# EasyEDA Pro project ACS Core.eprj, schematic Card Slot Reader

## Sheets
1 P1: Create Date: 2026-01-15; Page Name: P1; Project Name: Project Name; Schematic Name: Schematic Name; Update Date: 2021.11.05; Company: EasyEDA.com; Page Size: A4; Version: V1.0
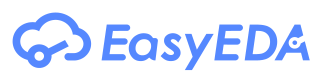
[diagram p0: P1]
2 NFC Reader: Board Name: Board1; Page Name: NFC Reader; Project Name: Card Reader 3.0.0; Schematic Name: Schematic1; Update Date: 2026-01-15
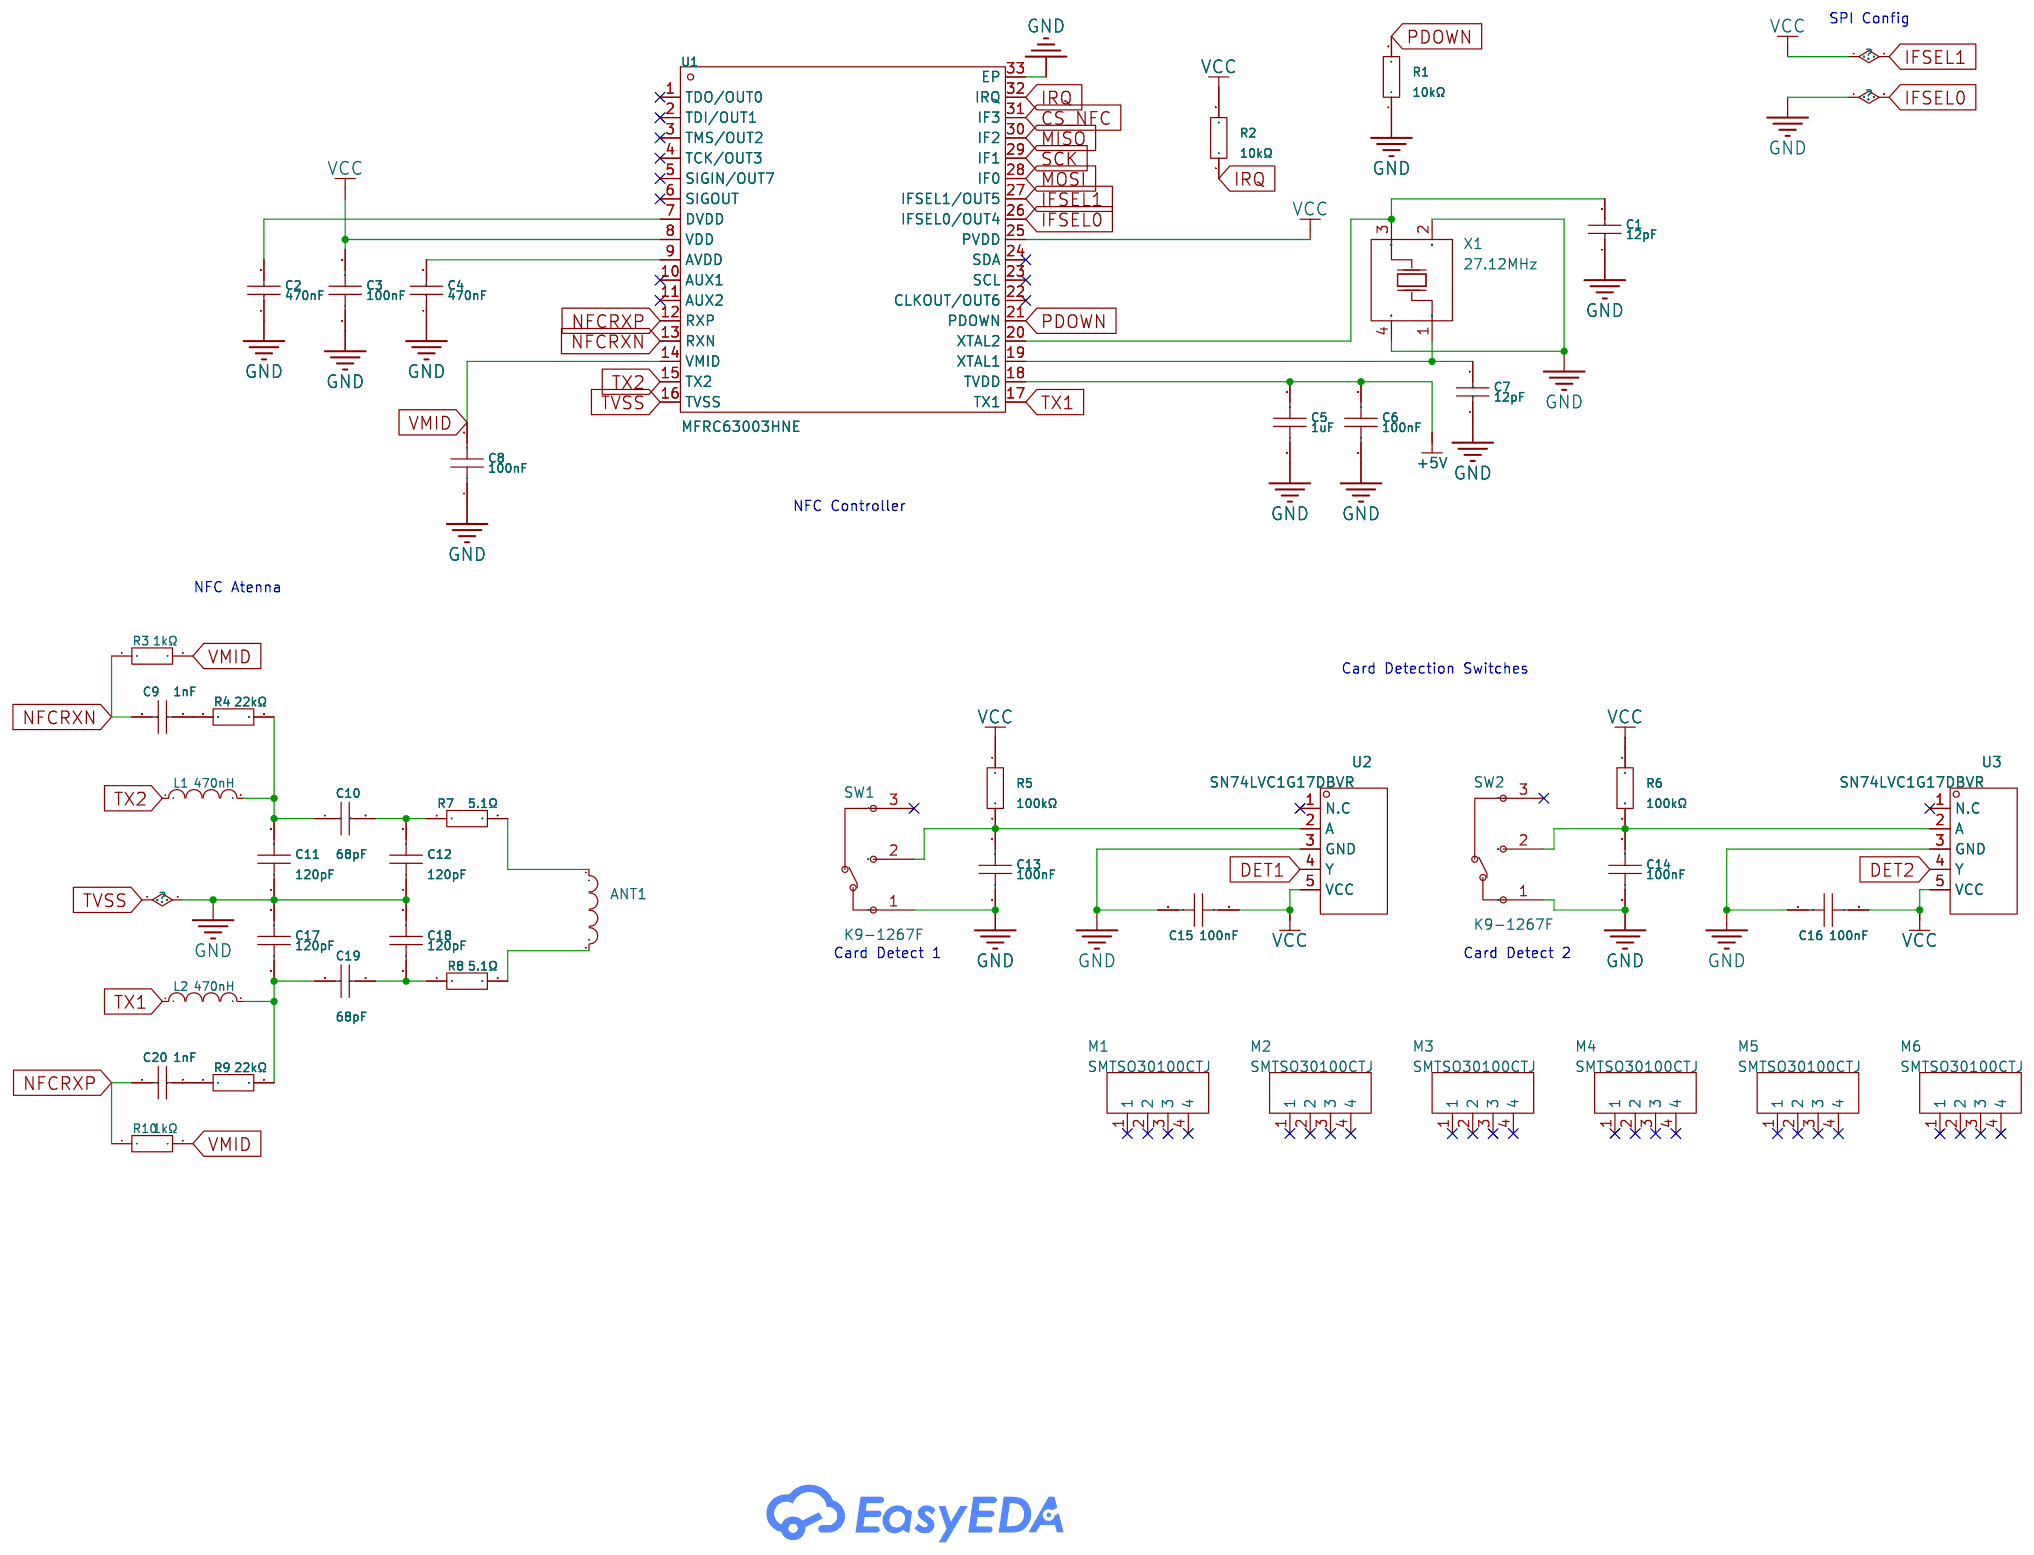
[diagram p1: NFC Reader]
3 Interfaces: Board Name: Card Slot Reader; Page Name: Interfaces; Project Name: ACS Core; Schematic Name: Card Slot Reader; Update Date: 2026-01-16
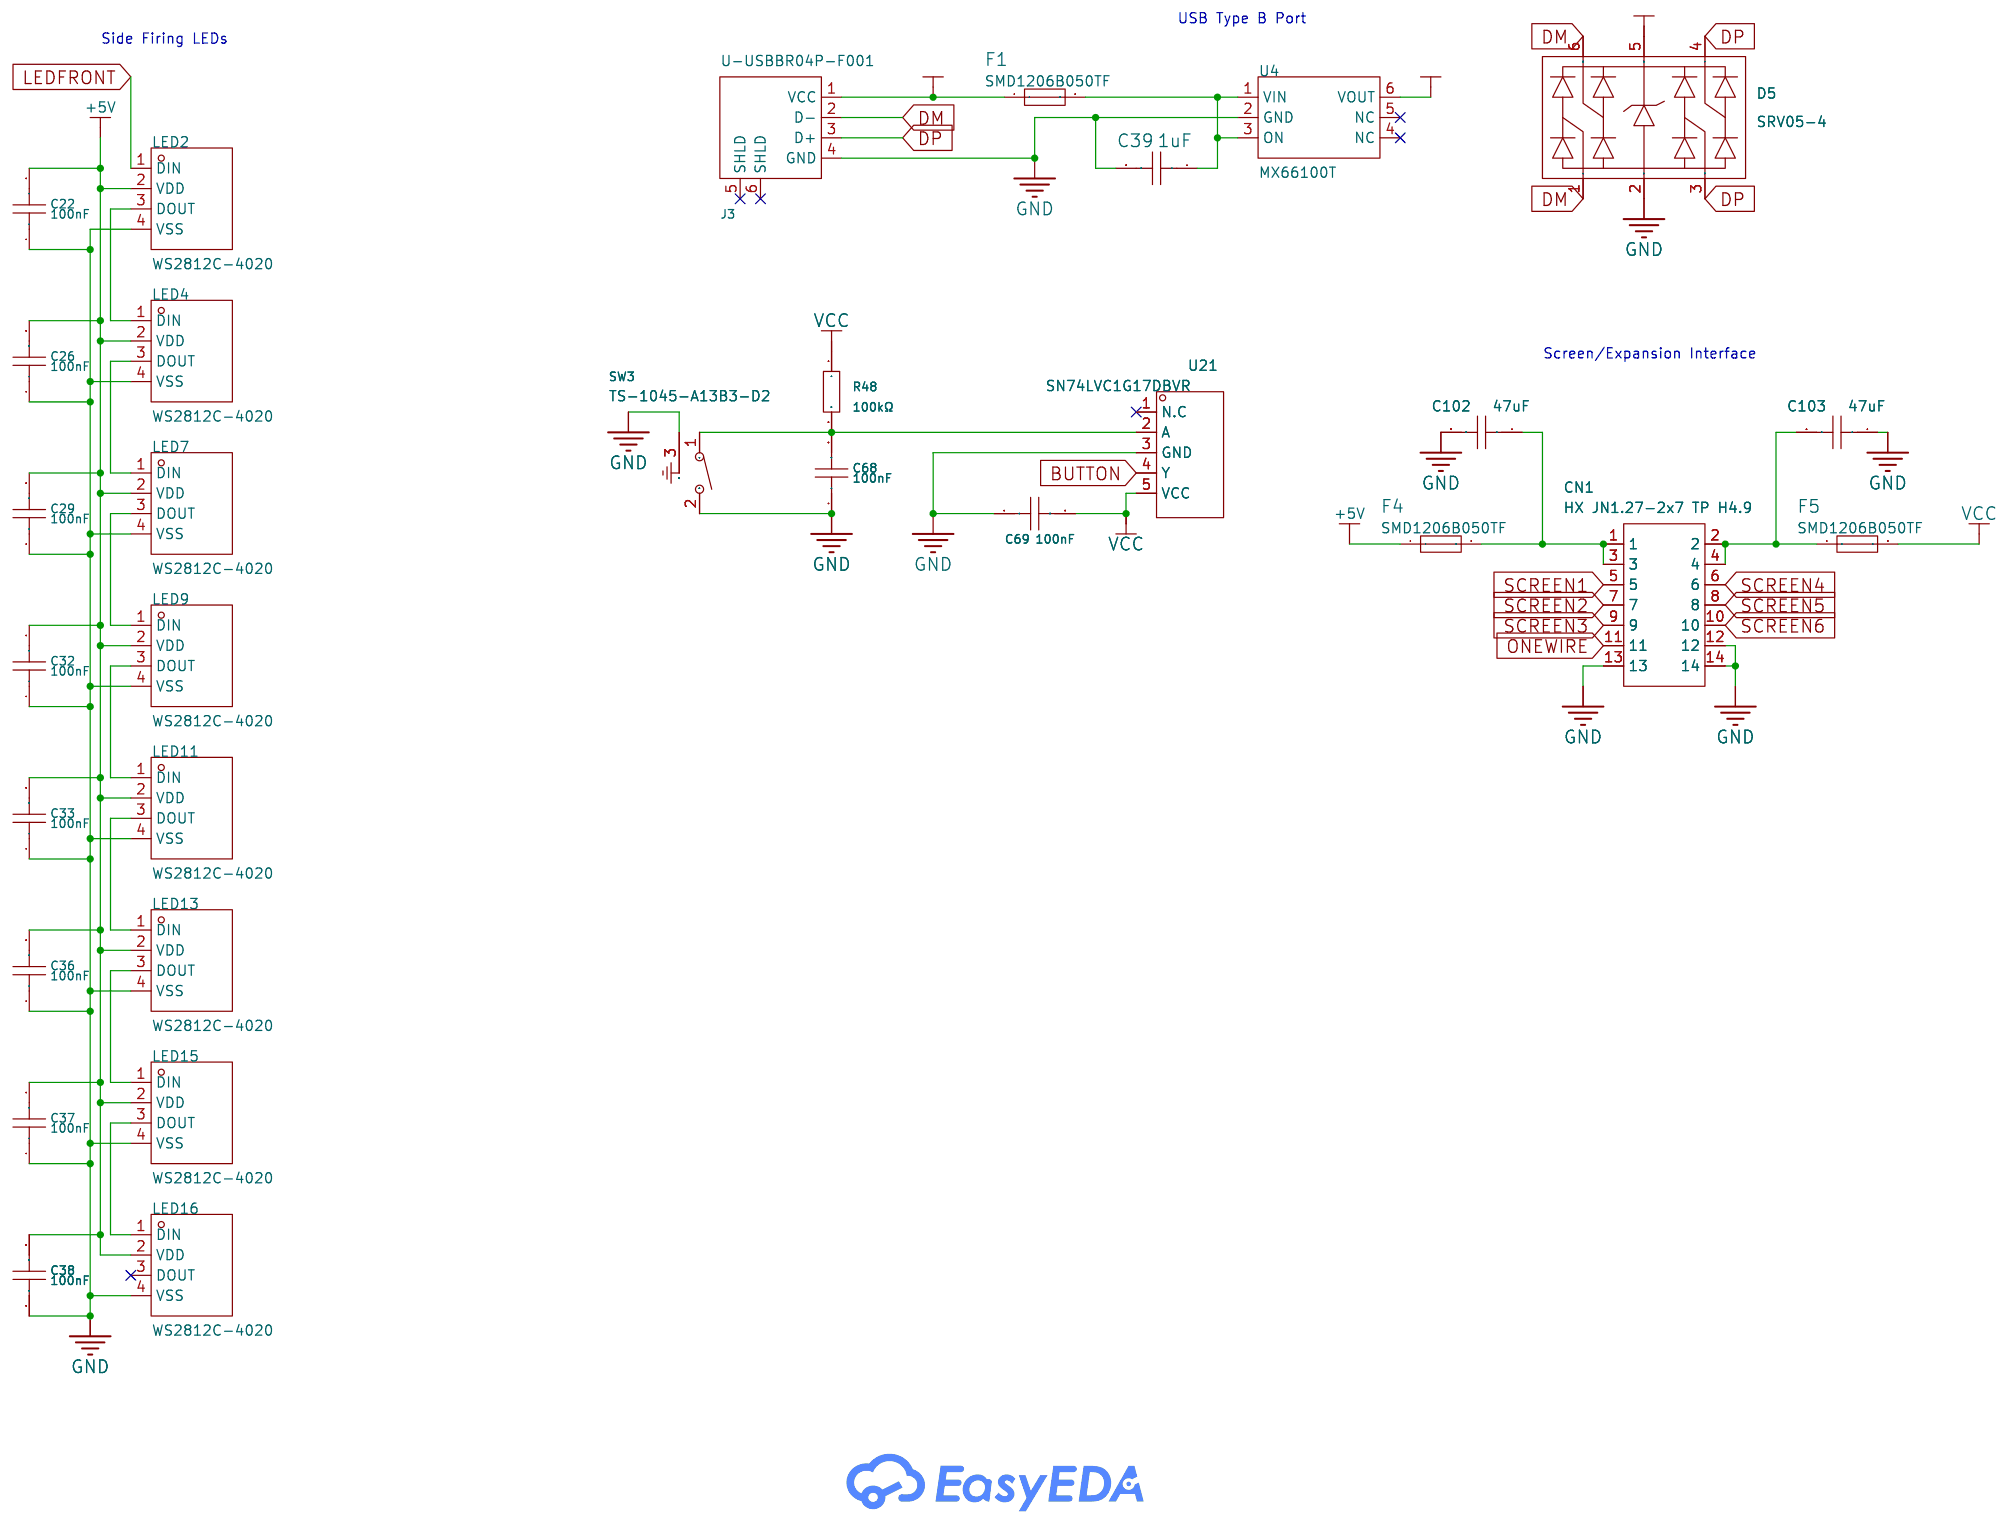
[diagram p2: Interfaces]
4 Bus Connection: Board Name: Card Slot Reader; Create Date: 2026-01-16; Page Name: Bus Connection; Project Name: ACS Core; Schematic Name: Card Slot Reader; Update Date: 2026-01-16
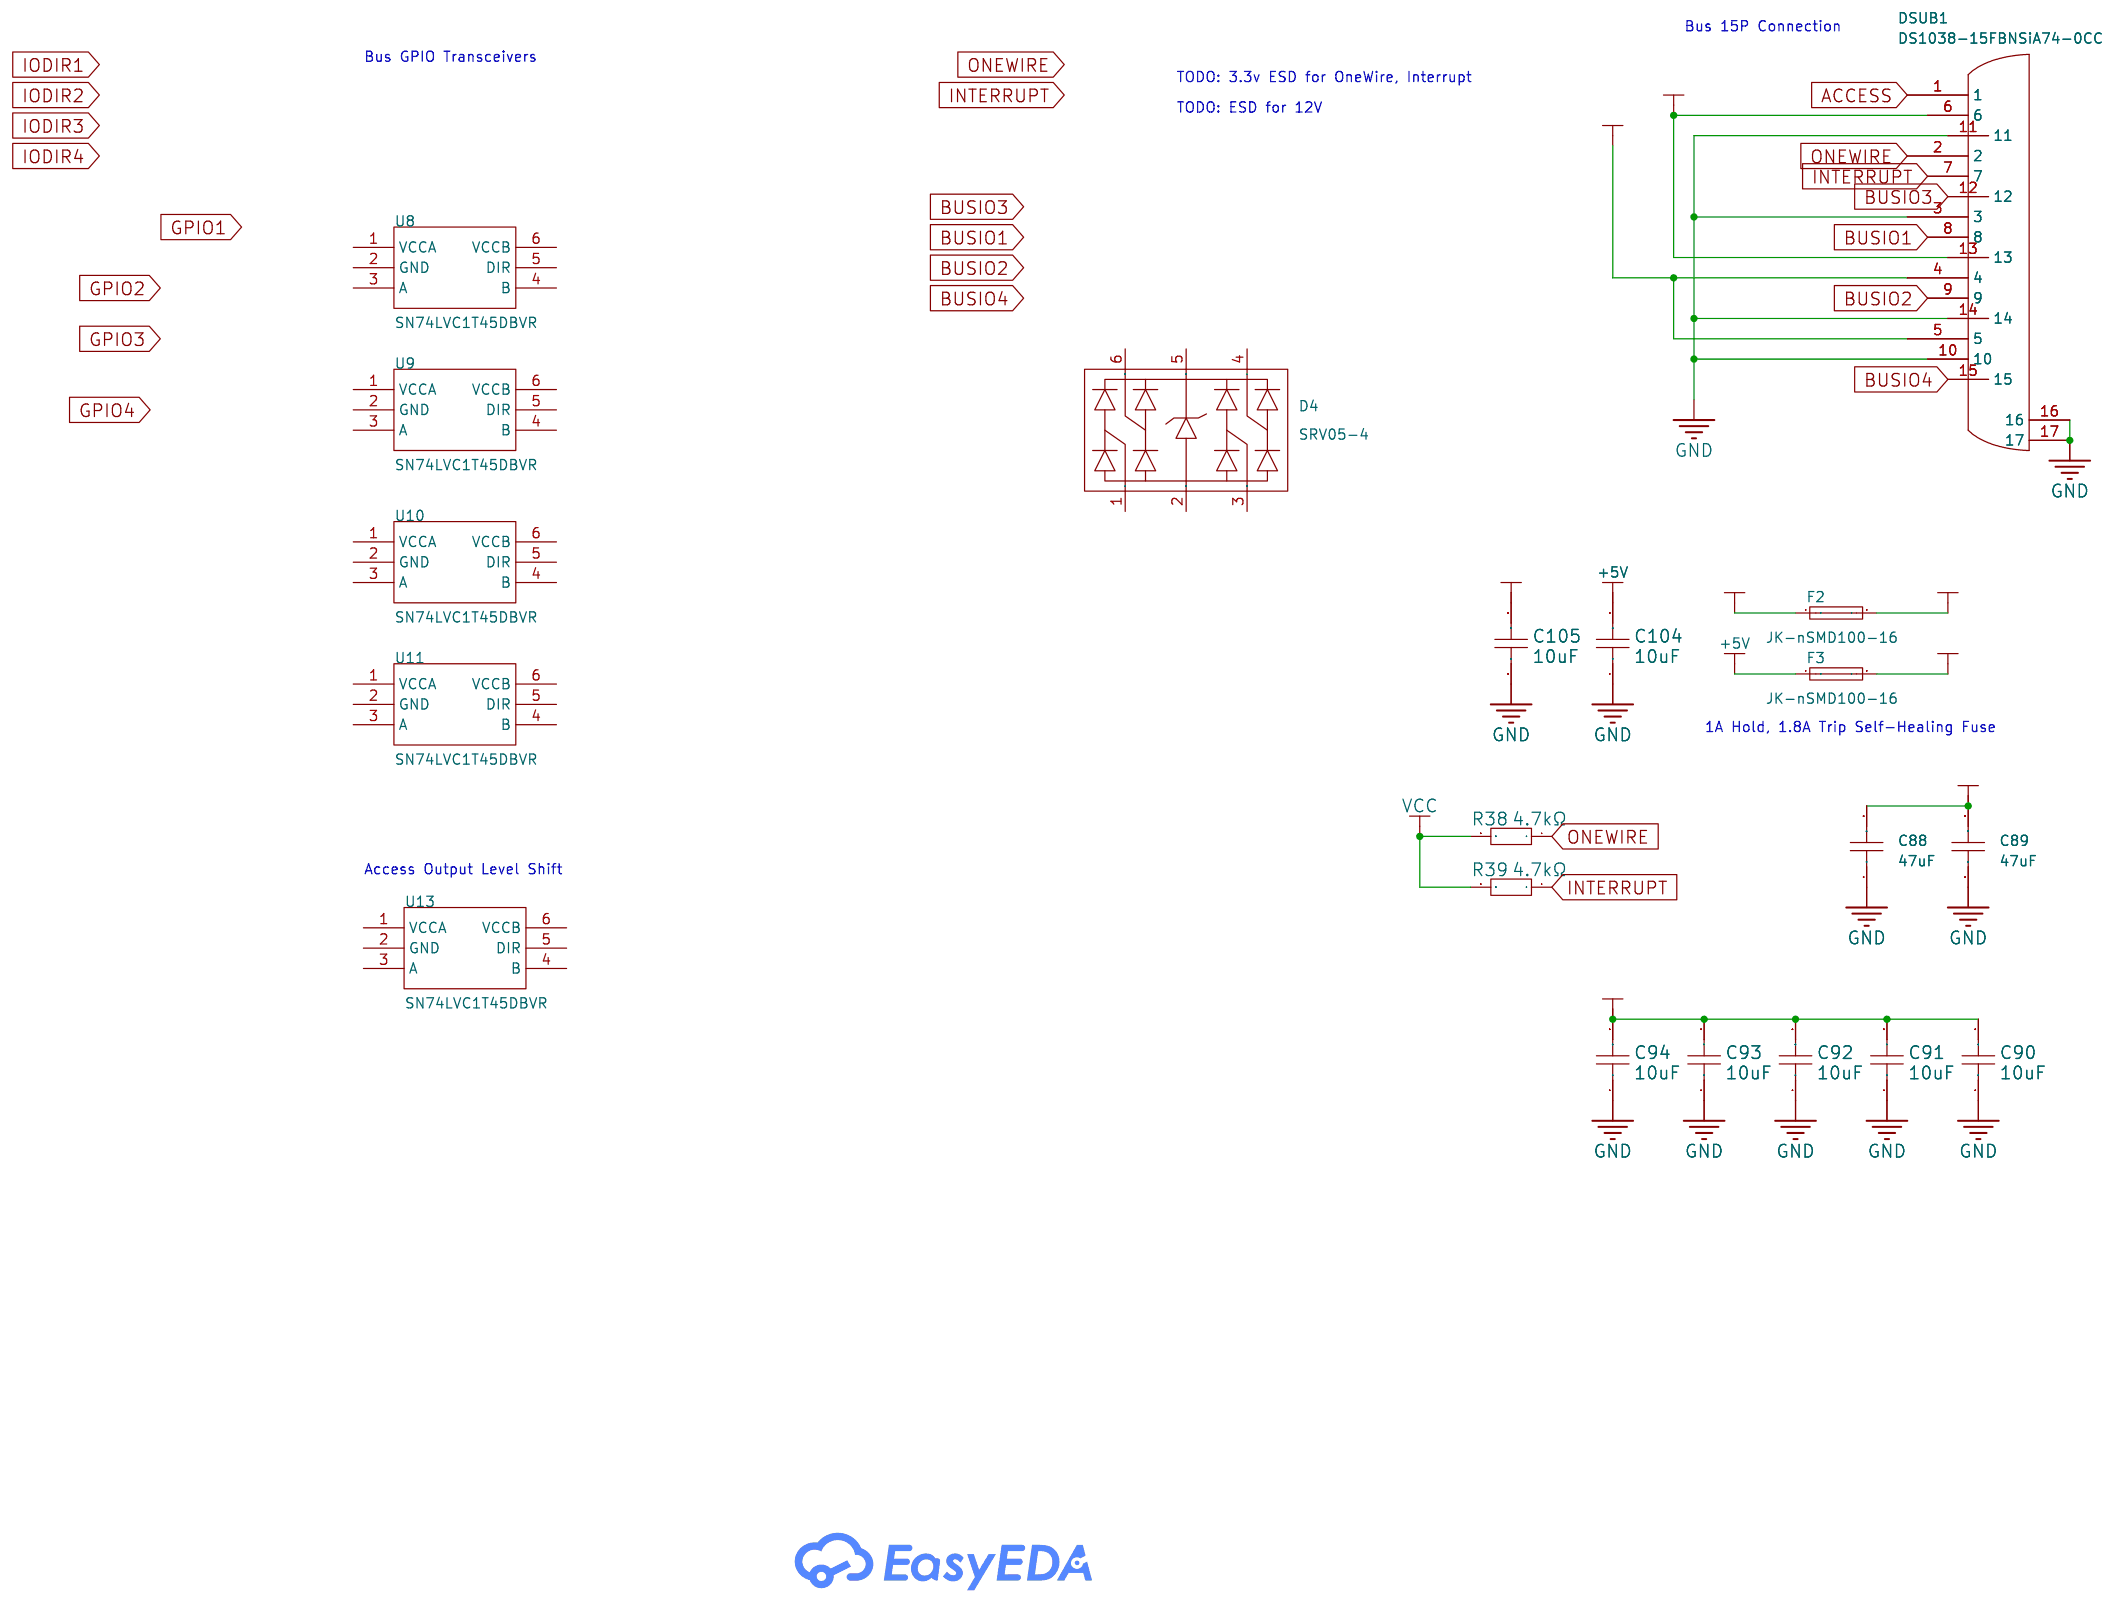
[diagram p3: Bus Connection]
5 Regulators: Board Name: Board1; Create Date: 2026-01-16; Page Name: Regulators; Project Name: Card Reader 3.0.0; Schematic Name: Schematic1; Update Date: 2026-01-16
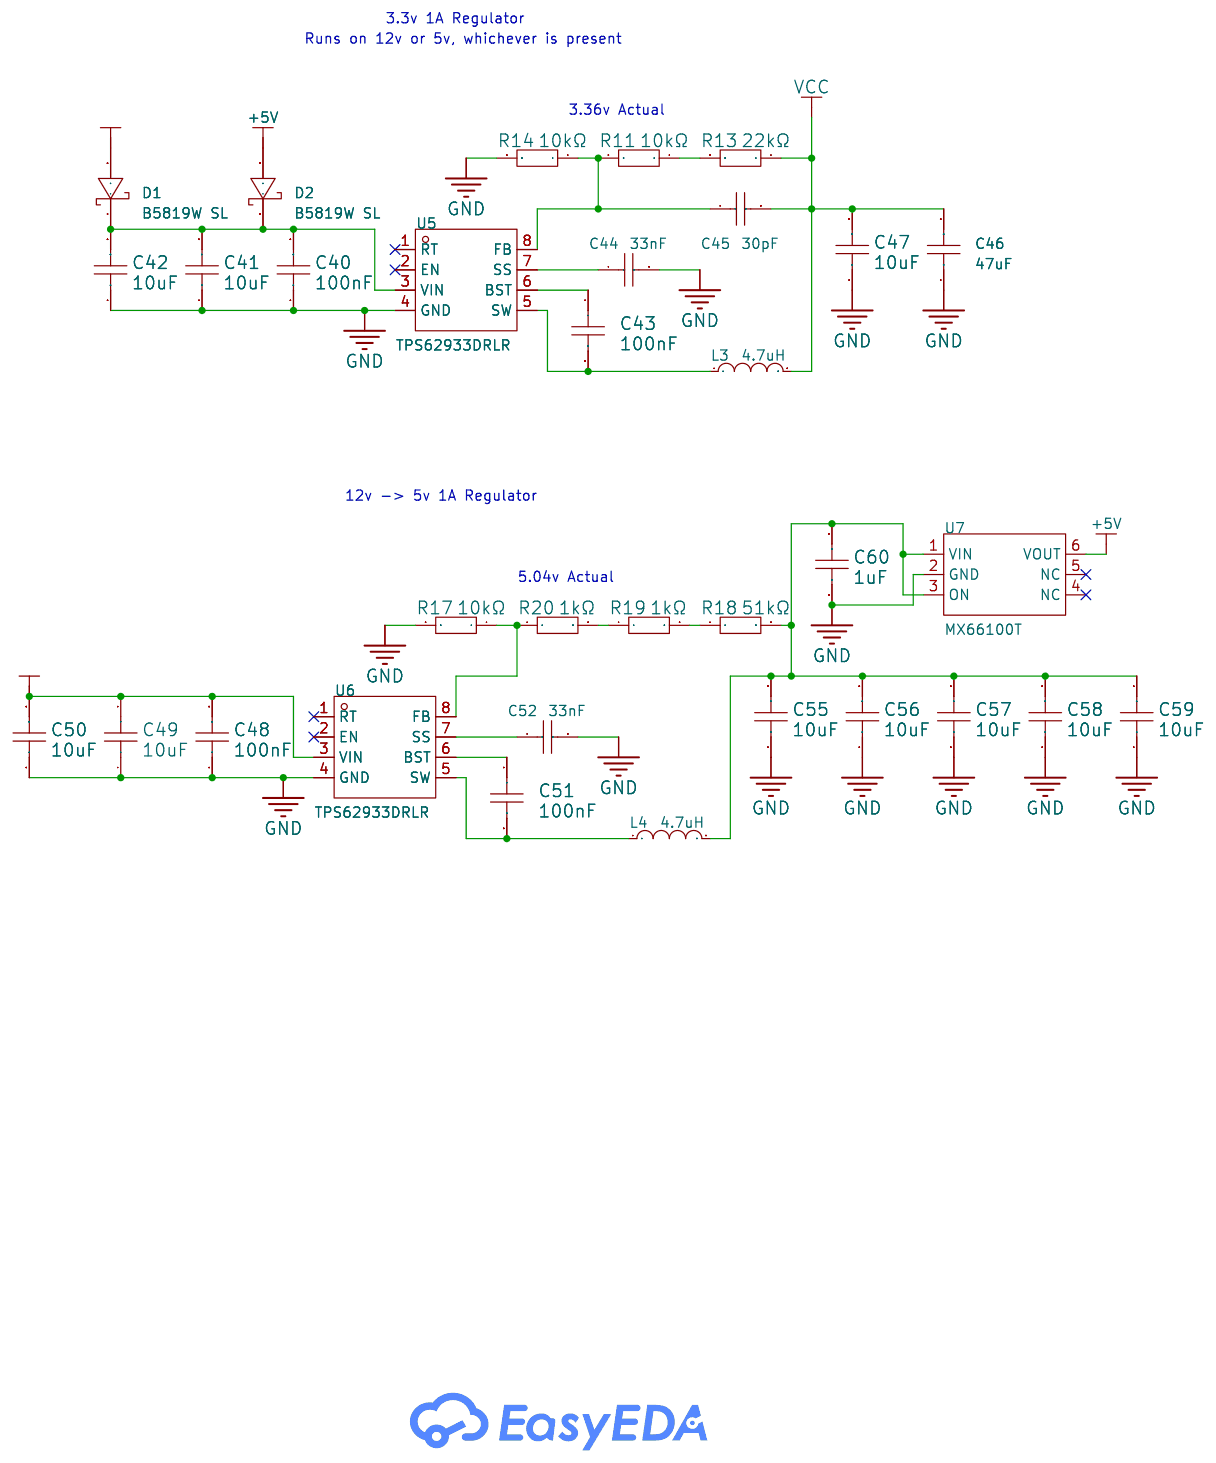
[diagram p4: Regulators]
6 Ethernet: Board Name: Board1; Create Date: 2026-01-16; Page Name: Ethernet; Project Name: Card Reader 3.0.0; Schematic Name: Schematic1; Update Date: 2026-01-16
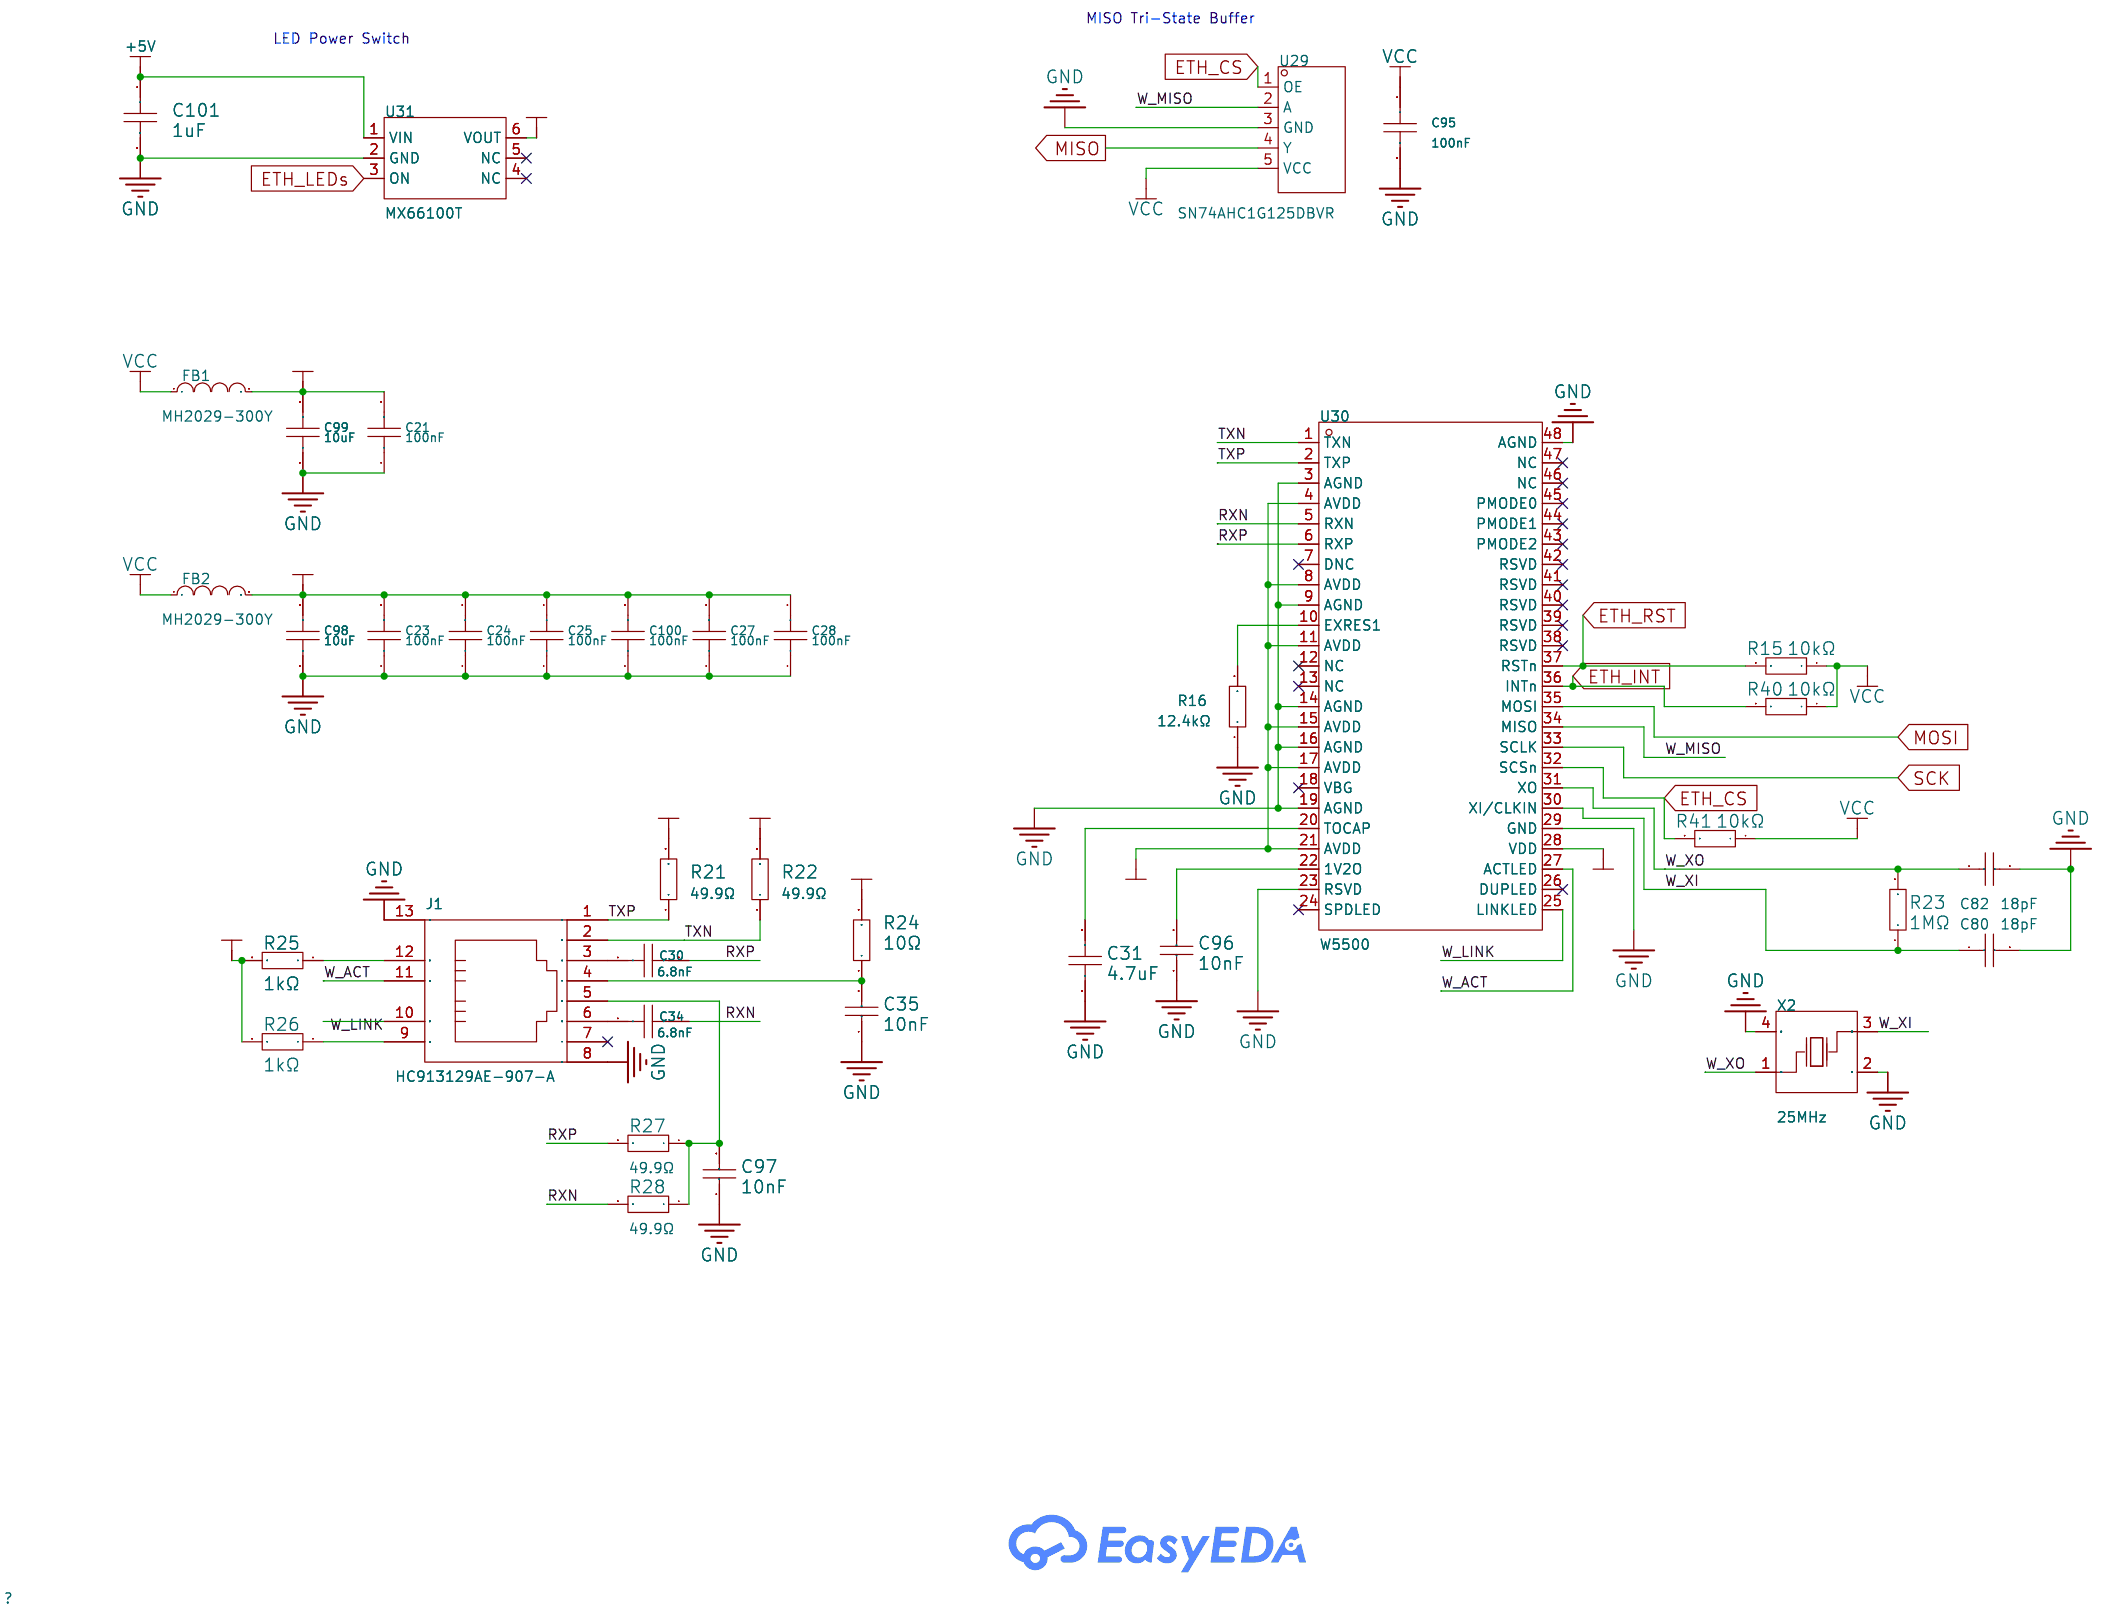
[diagram p5: Ethernet]

## Parts
sheet Bus Connection
C88  47uF  [C1206]
C89  47uF  [C1206]
C90  10uF  [C0603]
C91  10uF  [C0603]
C92  10uF  [C0603]
C93  10uF  [C0603]
C94  10uF  [C0603]
C104  10uF  [C0603]
C105  10uF  [C0603]
D4  SRV05-4  [SOT-23-6_L2.9-W1.6-P0.95-LS2.8-BL]
DSUB1  DS1038-15FBNSiA74-0CC  [DSUB-TH_DS1038-15FBNSIA74-0CC]
F2  JK-nSMD100-16  [F1206]
F3  JK-nSMD100-16  [F1206]
R38  4.7kΩ  [R0603]
R39  4.7kΩ  [R0603]
U8  SN74LVC1T45DBVR  [SOT-23-6_L2.9-W1.6-P0.95-LS2.8-BR]
U9  SN74LVC1T45DBVR  [SOT-23-6_L2.9-W1.6-P0.95-LS2.8-BR]
U10  SN74LVC1T45DBVR  [SOT-23-6_L2.9-W1.6-P0.95-LS2.8-BR]
U11  SN74LVC1T45DBVR  [SOT-23-6_L2.9-W1.6-P0.95-LS2.8-BR]
U13  SN74LVC1T45DBVR  [SOT-23-6_L2.9-W1.6-P0.95-LS2.8-BR]
sheet Ethernet
C21  100nF  [C0603]
C23  100nF  [C0603]
C24  100nF  [C0603]
C25  100nF  [C0603]
C27  100nF  [C0603]
C28  100nF  [C0603]
C30  6.8nF  [C0603]
C31  4.7uF  [C0603]
C34  6.8nF  [C0603]
C35  10nF  [C0603]
C80  18pF  [C0603]
C82  18pF  [C0603]
C95  100nF  [C0603]
C96  10nF  [C0603]
C97  10nF  [C0603]
C98  10uF  [C0603]
C99  10uF  [C0603]
C100  100nF  [C0603]
C101  1uF  [C0603]
FB1  MH2029-300Y  [L0805]
FB2  MH2029-300Y  [L0805]
J1  HC913129AE-907-A  [RJ45-TH_HC911102A-904-A]
R15  10kΩ  [R0603]
R16  12.4kΩ  [R0603]
R21  49.9Ω  [R0603]
R22  49.9Ω  [R0603]
R23  1MΩ  [R0603]
R24  10Ω  [R0603]
R25  1kΩ  [R0603]
R26  1kΩ  [R0603]
R27  49.9Ω  [R0603]
R28  49.9Ω  [R0603]
R40  10kΩ  [R0603]
R41  10kΩ  [R0603]
U29  SN74AHC1G125DBVR  [SOT-23-5_L3.0-W1.7-P0.95-LS2.8-BR]
U30  W5500  [LQFP-48_L7.0-W7.0-P0.50-LS9.0-BL]
U31  MX66100T  [SOT-23-6_L2.9-W1.6-P0.95-LS2.9-BL]
X2  25MHz  [CRYSTAL-SMD_4P-L3.2-W2.5-BL]
sheet Interfaces
C22  100nF  [C0603]
C26  100nF  [C0603]
C29  100nF  [C0603]
C32  100nF  [C0603]
C33  100nF  [C0603]
C36  100nF  [C0603]
C37  100nF  [C0603]
C38  100nF  [C0603]
C39  1uF  [C0603]
C68  100nF  [C0603]
C69  100nF  [C0603]
C102  47uF  [C1206]
C103  47uF  [C1206]
CN1  HX JN1.27-2x7 TP H4.9  [IDC-SMD_14P-P1.27_HXJN1.27-14P]
D5  SRV05-4  [SOT-23-6_L2.9-W1.6-P0.95-LS2.8-BL]
F1  SMD1206B050TF  [F1206]
F4  SMD1206B050TF  [F1206]
F5  SMD1206B050TF  [F1206]
J3  U-USBBR04P-F001  [USB-B-TH_U241-041N-1BR85-1]
LED2  WS2812C-4020  [LED-SMD_4P-L4.0-W1.7-R]
LED4  WS2812C-4020  [LED-SMD_4P-L4.0-W1.7-R]
LED7  WS2812C-4020  [LED-SMD_4P-L4.0-W1.7-R]
LED9  WS2812C-4020  [LED-SMD_4P-L4.0-W1.7-R]
LED11  WS2812C-4020  [LED-SMD_4P-L4.0-W1.7-R]
LED13  WS2812C-4020  [LED-SMD_4P-L4.0-W1.7-R]
LED15  WS2812C-4020  [LED-SMD_4P-L4.0-W1.7-R]
LED16  WS2812C-4020  [LED-SMD_4P-L4.0-W1.7-R]
R48  100kΩ  [R0603]
SW3  TS-1045-A13B3-D2  [SW-SMD_L7.5-W8.0-P4.50_TS-1045-A13B3-D2]
U4  MX66100T  [SOT-23-6_L2.9-W1.6-P0.95-LS2.9-BL]
U21  SN74LVC1G17DBVR  [SOT-23-5_L3.0-W1.7-P0.95-LS2.8-BR]
sheet NFC Reader
ANT1  -  [NFC Antenna Footprint]
C1  12pF  [C0603]
C2  470nF  [C0603]
C3  100nF  [C0603]
C4  470nF  [C0603]
C5  1uF  [C0603]
C6  100nF  [C0603]
C7  12pF  [C0603]
C8  100nF  [C0603]
C9  1nF  [C0603]
C10  68pF  [C0603]
C11  120pF  [C0603]
C12  120pF  [C0603]
C13  100nF  [C0603]
C14  100nF  [C0603]
C15  100nF  [C0603]
C16  100nF  [C0603]
C17  120pF  [C0603]
C18  120pF  [C0603]
C19  68pF  [C0603]
C20  1nF  [C0603]
L1  470nH  [L0603]
L2  470nH  [L0603]
M1  SMTSO30100CTJ  [SCREW-SMD_BD5.6-D4.1-H10]
M2  SMTSO30100CTJ  [SCREW-SMD_BD5.6-D4.1-H10]
M3  SMTSO30100CTJ  [SCREW-SMD_BD5.6-D4.1-H10]
M4  SMTSO30100CTJ  [SCREW-SMD_BD5.6-D4.1-H10]
M5  SMTSO30100CTJ  [SCREW-SMD_BD5.6-D4.1-H10]
M6  SMTSO30100CTJ  [SCREW-SMD_BD5.6-D4.1-H10]
R1  10kΩ  [R0603]
R2  10kΩ  [R0603]
R3  1kΩ  [R0603]
R4  22kΩ  [R0603]
R5  100kΩ  [R0603]
R6  100kΩ  [R0603]
R7  5.1Ω  [R0603]
R8  5.1Ω  [R0603]
R9  22kΩ  [R0603]
R10  1kΩ  [R0603]
SW1  K9-1267F  [SW-TH_K9-1267F]
SW2  K9-1267F  [SW-TH_K9-1267F]
U1  MFRC63003HNE  [HVQFN-32_L5.0-W5.0-P0.50-TL-EP3.1]
U2  SN74LVC1G17DBVR  [SOT-23-5_L3.0-W1.7-P0.95-LS2.8-BR]
U3  SN74LVC1G17DBVR  [SOT-23-5_L3.0-W1.7-P0.95-LS2.8-BR]
X1  27.12MHz  [CRYSTAL-SMD_4P-L3.2-W2.5-BL-1]
sheet Regulators
C40  100nF  [C0603]
C41  10uF  [C0603]
C42  10uF  [C0603]
C43  100nF  [C0603]
C44  33nF  [C0603]
C45  30pF  [C0603]
C46  47uF  [C1206]
C47  10uF  [C0603]
C48  100nF  [C0603]
C49  10uF  [C0603]
C50  10uF  [C0603]
C51  100nF  [C0603]
C52  33nF  [C0603]
C55  10uF  [C0603]
C56  10uF  [C0603]
C57  10uF  [C0603]
C58  10uF  [C0603]
C59  10uF  [C0603]
C60  1uF  [C0603]
D1  B5819W SL  [SOD-123_L2.7-W1.6-LS3.7-RD-1]
D2  B5819W SL  [SOD-123_L2.7-W1.6-LS3.7-RD-1]
L3  4.7uH  [IND-SMD_L7.1-W6.6]
L4  4.7uH  [IND-SMD_L7.1-W6.6]
R11  10kΩ  [R0603]
R13  22kΩ  [R0603]
R14  10kΩ  [R0603]
R17  10kΩ  [R0603]
R18  51kΩ  [R0603]
R19  1kΩ  [R0603]
R20  1kΩ  [R0603]
U5  TPS62933DRLR  [SOT-583-8_L2.1-W1.2-P0.50-LS1.6-BR]
U6  TPS62933DRLR  [SOT-583-8_L2.1-W1.2-P0.50-LS1.6-BR]
U7  MX66100T  [SOT-23-6_L2.9-W1.6-P0.95-LS2.9-BL]

## Library data of the parts
C88 C89 = CL31A476MPHNNNE: LCSC Part Name: 47uF ±20% 10V; Supplier Part: C96123; Manufacturer: SAMSUNG(三星); Supplier Footprint: 1206; JLCPCB Part Class: Basic Part; Datasheet: https://item.szlcsc.com/datasheet/CL31A476MPHNNNE/97327.html; Supplier: LCSC; Tolerance: ±20%; Voltage Rating: 10V; Temperature Coefficient: X5R
C41 C42 C47 C49 C50 C55-C59 C90-C94 C98 C99 C104 C105 = CL10A106MA8NRNC: LCSC Part Name: 10uF ±20% 25V; Supplier Part: C96446; Manufacturer: SAMSUNG(三星); Supplier Footprint: 0603; JLCPCB Part Class: Basic Part; Datasheet: https://item.szlcsc.com/datasheet/CL10A106MA8NRNC/97651.html; Supplier: LCSC; Tolerance: ±20%; Voltage Rating: 25V; Temperature Coefficient: X5R
D4 D5 = SRV05-4_C558418: polarity:Unidirectional Reverse Stand-Off Voltage (Vrwm):5V Maximum Clamping Voltage:20V Peak Pulse Current (Ipp):3A Peak Pulse Power Dissipation (Ppp):60W Breakdown Voltage:6V Reverse Leakage Current (Ir):500nA Number of Lines:Four channels Operating Tem; LCSC Part Name: ESD，可防25kV静电; Supplier Part: C558418; Manufacturer: TECH PUBLIC(台舟); Supplier Footprint: SOT-23-6; JLCPCB Part Class: Extended Part; Datasheet: https://atta.szlcsc.com/upload/public/pdf/source/20230615/CFFDFFE99FDA0E92DF9600783B3A2A20.pdf; Supplier: LCSC; polarity: Unidirectional; Reverse Stand-Off Voltage (Vrwm): 5V; Maximum Clamping Voltage: 20V; Peak Pulse Current (Ipp): 3A; Peak Pulse Power Dissipation (Ppp): 60W; Breakdown Voltage: 6V; Reverse Leakage Current (Ir): 500nA; Number of Lines: Four channels; Operating Temperature: -55℃~+125℃; level of protection: IEC 61000-4-2; Type: ESD
DSUB1 = DS1038-15FBNSiA74-0CC: LCSC Part Name: 黑色 1000/盒 D-Sub 母 P数:15P; Supplier Part: C75754; Manufacturer: CONNFLY; Supplier Footprint: 弯插; JLCPCB Part Class: Extended Part; Datasheet: https://item.szlcsc.com/datasheet/DS1038-15FBNSiA74-0CC/76880.html; Supplier: LCSC; Connector Type: High Density D-Sub; Gender: Female; Number of Pins: 15P; Mounting Type: Right Angle; Number of Rows: 3; Current Rating-Signal: 3A; Color: Black; Operating Temperature: -40℃~+105℃
F2 F3 = JK-nSMD100-16_C369161: LCSC Part Name: 16V 1A 1206自恢复; Supplier Part: C369161; Manufacturer: JK(金科); Supplier Footprint: 1206; Datasheet: https://item.szlcsc.com/datasheet/JK-nSMD100-16/343074.html; Supplier: LCSC; Voltage - Max: 16V; Current - Max: 100A; Hold Current: 1A; Trip Current: 1.8A; Resistance - Initial (Ri) (Min): 55mΩ; Resistance - Post Trip (R1) (Max): 330mΩ; Time to Trip(Max): 300ms; Operating Temperature: -40℃~+85℃; Length: 3.5mm; Width: 1.8mm; Height: 1.3mm
R38 R39 = 0603WAF4701T5E: Type:Thick Film Resistors Resistance:4.7kΩ Tolerance:±1% Tolerance:±1% Power(Watts): Overload Voltage (Max): Temperature Coefficient:±100ppm/℃ Temperature Coefficient:±100ppm/℃ Operating Temperature Range:-55℃~+155℃ Operating Temperature Range:-55℃~+155℃; LCSC Part Name: 4.7kΩ ±1% 100mW 厚膜电阻; Supplier Part: C23162; Manufacturer: UNI-ROYAL(厚声); Supplier Footprint: 0603; JLCPCB Part Class: Basic Part; Datasheet: https://atta.szlcsc.com/upload/public/pdf/source/20200306/C422600_1E6D84923E4A46A82E41ADD87F860B5C.pdf; Supplier: LCSC; Type: Thick Film Resistors; Tolerance: ±1%; Temperature Coefficient: ±100ppm/℃; Operating Temperature Range: -55℃~+155℃
U8-U11 U13 = SN74LVC1T45DBVR: Supplier Part: C7843; Manufacturer: TI(德州仪器); Supplier Footprint: SOT-23-6; Datasheet: https://www.ti.com/cn/lit/gpn/sn74lvc1t45; Supplier: LCSC; Channel Type: Bidirectional; Data Rate: 420Mbps; Voltage - Supply(VCCA): 1.65V~5.5V; Voltage - Supply(VCCB): 1.65V~5.5V; Number of Circuits: 1; Output Type: Tri-State; Operating Temperature: -40℃~+85℃
C3 C6 C8 C13-C16 C21-C29 C32 C33 C36-C38 C40 C43 C48 C51 C68 C69 C95 C100 = CC0603KRX7R9BB104: Capacitance: Tolerance:±10% Tolerance:±10% Voltage Rated: Temperature Coefficient:; LCSC Part Name: 100nF ±10% 50V; Supplier Part: C14663; Manufacturer: YAGEO(国巨); Supplier Footprint: 0603; JLCPCB Part Class: Basic Part; Datasheet: https://atta.szlcsc.com/upload/public/pdf/source/20180910/C282072_33301C7F631E79921B82A8DAC6BCC5B3.pdf; Supplier: LCSC; Tolerance: ±10%
C30 C34 = C1608X7R2A682KT000N: Capacitance: Tolerance:±10% Tolerance:±10% Voltage Rated: Temperature Coefficient:; LCSC Part Name: 6.8nF ±10% 100V; Supplier Part: C694293; Manufacturer: TDK; Supplier Footprint: 0603; JLCPCB Part Class: Extended Part; Datasheet: https://atta.szlcsc.com/upload/public/pdf/source/20191129/C465875_2B14C4D62A20D308712483249251ED98.pdf; Supplier: LCSC; Tolerance: ±10%
C31 = CL10A475KO8NNNC: Capacitance: Tolerance:±10% Tolerance:±10% Voltage Rated: Temperature Coefficient:; LCSC Part Name: 4.7uF ±10% 16V; Supplier Part: C19666; Manufacturer: SAMSUNG(三星); Supplier Footprint: 0603; JLCPCB Part Class: Basic Part; Datasheet: https://atta.szlcsc.com/upload/public/pdf/source/20160218/1457707763339.pdf; Supplier: LCSC; Tolerance: ±10%
C35 C96 C97 = 0603B103K500NT: Capacitance:10nF Tolerance:±10% Tolerance:±10% Voltage Rated: Temperature Coefficient:; LCSC Part Name: 10nF ±10% 50V; Supplier Part: C57112; Manufacturer: FH(风华); Supplier Footprint: 0603; JLCPCB Part Class: Basic Part; Datasheet: https://atta.szlcsc.com/upload/public/pdf/source/20200305/C486355_26A10D38EF8C2A5C37091D0039909270.pdf; Supplier: LCSC; Tolerance: ±10%
C80 C82 = CL10C180JB8NNNC: Capacitance: Tolerance:±5% Tolerance:±5% Voltage Rated: Temperature Coefficient:; LCSC Part Name: 18pF ±5% 50V; Supplier Part: C1647; Manufacturer: SAMSUNG(三星); Supplier Footprint: 0603; JLCPCB Part Class: Basic Part; Datasheet: https://atta.szlcsc.com/upload/public/pdf/source/20160218/1457707763339.pdf; Supplier: LCSC; Tolerance: ±5%
C5 C39 C60 C101 = CL10A105KB8NNNC: Capacitance: Tolerance:±10% Tolerance:±10% Voltage Rated: Temperature Coefficient:; LCSC Part Name: 1uF ±10% 50V; Supplier Part: C15849; Manufacturer: SAMSUNG(三星); Supplier Footprint: 0603; JLCPCB Part Class: Basic Part; Datasheet: https://atta.szlcsc.com/upload/public/pdf/source/20160218/1457707763339.pdf; Supplier: LCSC; Tolerance: ±10%
FB1 FB2 = MH2029-300Y: Impedance @ Frequency:30Ω@100MHz Tolerance:±25% Tolerance:±25% DC Resistance:25mΩ Current Rating:3A Circuits:1; LCSC Part Name: 单路 0805磁珠 阻抗30Ω@100MHz; Supplier Part: C840593; Manufacturer: BOURNS; Supplier Footprint: 0805; JLCPCB Part Class: Extended Part; Datasheet: https://atta.szlcsc.com/upload/public/pdf/source/20200907/C780182_6AA2A849D07FE675FBDEC0D82719ED6E.pdf; Supplier: LCSC; Impedance @ Frequency: 30Ω@100MHz; Tolerance: ±25%; DC Resistance: 25mΩ; Current Rating: 3A; Circuits: 1
J1 = HC913129AE-907-A: Connector Type:RJ45Receptacle Number of Ports:1 Mounting Style:Right-Angle Shielding:有屏蔽 LED:WithLED Contact Material:Phosphor bronze Contact Plating:Gold Operating Temperature Range:-40℃~+85℃ Operating Temperature Range:-40℃~+85℃ Soldering Temperature(Ma; LCSC Part Name: 弯插 带LED; Supplier Part: C5341218; Manufacturer: HCTL(华灿天禄); Supplier Footprint: 插件; JLCPCB Part Class: Extended Part; Datasheet: https://atta.szlcsc.com/upload/public/pdf/source/20230620/1EF30919FD4FC73383A5674A58476AE5.pdf; Supplier: LCSC; Connector Type: RJ45Receptacle; Number of Ports: 1; Mounting Style: Right-Angle; Shielding: 有屏蔽; LED: WithLED; Contact Material: Phosphor bronze; Contact Plating: Gold; Operating Temperature Range: -40℃~+85℃; Soldering Temperature(Max): 260℃@5S
R1 R2 R11 R14 R15 R17 R40 R41 = 0603WAF1002T5E: Type:Thick Film Resistors Resistance:10kΩ Tolerance:±1% Tolerance:±1% Power(Watts): Overload Voltage (Max): Temperature Coefficient:±100ppm/℃ Temperature Coefficient:±100ppm/℃ Operating Temperature Range:-55℃~+155℃ Operating Temperature Range:-55℃~+155℃; LCSC Part Name: 厚膜电阻 10kΩ ±1% 100mW; Supplier Part: C25804; Manufacturer: UNI-ROYAL(厚声); Supplier Footprint: 0603; JLCPCB Part Class: Basic Part; Datasheet: https://atta.szlcsc.com/upload/public/pdf/source/20200306/C422600_1E6D84923E4A46A82E41ADD87F860B5C.pdf; Supplier: LCSC; Type: Thick Film Resistors; Tolerance: ±1%; Temperature Coefficient: ±100ppm/℃; Operating Temperature Range: -55℃~+155℃
R16 = RTT031242FTP: Type:Thick Film Resistors Resistance: Tolerance:±1% Tolerance:±1% Power(Watts): Overload Voltage (Max): Temperature Coefficient:±100ppm/℃ Temperature Coefficient:±100ppm/℃ Operating Temperature Range:-55℃~+155℃ Operating Temperature Range:-55℃~+155℃; LCSC Part Name: 厚膜电阻 12.4kΩ ±1% 100mW; Supplier Part: C103261; Manufacturer: RALEC(旺诠); Supplier Footprint: 0603; JLCPCB Part Class: Extended Part; Datasheet: https://atta.szlcsc.com/upload/public/pdf/source/20191219/C158410_884373A5B7E1BC76BF57BC45A946C093.pdf; Supplier: LCSC; Type: Thick Film Resistors; Tolerance: ±1%; Temperature Coefficient: ±100ppm/℃; Operating Temperature Range: -55℃~+155℃
R21 R22 R27 R28 = RC0603DR-0749R9L: 100mW Thick Film Resistors ±100ppm/℃ ±0.5% 49.9Ω 0603  Chip Resistor - Surface Mount ROHS; LCSC Part Name: C859049; Supplier Part: C859049; Manufacturer: UNI-ROYAL(厚声); Manufacturer Part: 0603WAF1002T5E; Supplier Footprint: 0603; JLCPCB Part Class: Extended Part; Datasheet: https://atta.szlcsc.com/upload/public/pdf/source/20200306/C422600_1E6D84923E4A46A82E41ADD87F860B5C.pdf; Supplier: LCSC; Type: Thick Film Resistors; Tolerance: ±1%; Temperature Coefficient: ±100ppm/℃; Operating Temperature Range: -55℃~+155℃
R23 = 0603WAF1004T5E: Type:Thick Film Resistors Resistance:1MΩ Tolerance:±1% Tolerance:±1% Power(Watts): Overload Voltage (Max): Temperature Coefficient:±100ppm/℃ Temperature Coefficient:±100ppm/℃ Operating Temperature Range:-55℃~+155℃ Operating Temperature Range:-55℃~+155℃; LCSC Part Name: 1MΩ ±1% 100mW 厚膜电阻; Supplier Part: C22935; Manufacturer: UNI-ROYAL(厚声); Supplier Footprint: 0603; JLCPCB Part Class: Basic Part; Datasheet: https://atta.szlcsc.com/upload/public/pdf/source/20200306/C422600_1E6D84923E4A46A82E41ADD87F860B5C.pdf; Supplier: LCSC; Type: Thick Film Resistors; Tolerance: ±1%; Temperature Coefficient: ±100ppm/℃; Operating Temperature Range: -55℃~+155℃
R24 = 0603WAF100JT5E: Type:Thick Film Resistors Resistance:10Ω Tolerance:±1% Tolerance:±1% Power(Watts): Overload Voltage (Max): Temperature Coefficient:±400ppm/℃ Temperature Coefficient:±400ppm/℃ Operating Temperature Range:-55℃~+155℃ Operating Temperature Range:-55℃~+155℃; LCSC Part Name: 10Ω ±1% 100mW 厚膜电阻; Supplier Part: C22859; Manufacturer: UNI-ROYAL(厚声); Supplier Footprint: 0603; JLCPCB Part Class: Basic Part; Datasheet: https://atta.szlcsc.com/upload/public/pdf/source/20200306/C422600_1E6D84923E4A46A82E41ADD87F860B5C.pdf; Supplier: LCSC; Type: Thick Film Resistors; Tolerance: ±1%; Temperature Coefficient: ±400ppm/℃; Operating Temperature Range: -55℃~+155℃
R3 R10 R19 R20 R25 R26 = 0603WAF1001T5E: Type:Thick Film Resistors Resistance:1kΩ Tolerance:±1% Tolerance:±1% Power(Watts): Overload Voltage (Max): Temperature Coefficient:±100ppm/℃ Temperature Coefficient:±100ppm/℃ Operating Temperature Range:-55℃~+155℃ Operating Temperature Range:-55℃~+155℃; LCSC Part Name: 1kΩ ±1% 100mW 厚膜电阻; Supplier Part: C21190; Manufacturer: UNI-ROYAL(厚声); Supplier Footprint: 0603; JLCPCB Part Class: Basic Part; Datasheet: https://atta.szlcsc.com/upload/public/pdf/source/20200306/C422600_1E6D84923E4A46A82E41ADD87F860B5C.pdf; Supplier: LCSC; Type: Thick Film Resistors; Tolerance: ±1%; Temperature Coefficient: ±100ppm/℃; Operating Temperature Range: -55℃~+155℃
U29 = SN74AHC1G125DBVR: Input type:- output type:Tri-State Supply Voltage:2V~5.5V Supply Voltage:2V~5.5V Number of Elements:1 Number of Bits per Element:1 Sink Current:8mA Source Current:8mA Logic Family:74AHC Operating Temperature:-40℃~+125℃ Operating Temperature:-40℃~+125℃; Supplier Part: C7468; Manufacturer: TI(德州仪器); Supplier Footprint: SOT-23-5; JLCPCB Part Class: Extended Part; Datasheet: https://www.ti.com/cn/lit/gpn/sn74ahc1g125; Supplier: LCSC; output type: Tri-State; Supply Voltage: 2V~5.5V; Number of Elements: 1; Number of Bits per Element: 1; Sink Current: 8mA; Source Current: 8mA; Logic Family: 74AHC; Operating Temperature: -40℃~+125℃
U30 = W5500: LCSC Part Name: 硬连线TCP/IP嵌入式以太网控制器; Supplier Part: C32843; Manufacturer: WIZNET; Supplier Footprint: LQFP-48(7x7); JLCPCB Part Class: Extended Part; Datasheet: https://atta.szlcsc.com/upload/public/pdf/source/20230714/E10C32B058E0BA54FCE1C1556BE10C07.pdf; Supplier: LCSC
U4 U7 U31 = MX66100T: LCSC Part Name: 1V to 5.5V、2A、100mΩ理想二极管; Supplier Part: C53121238; Manufacturer: Wuxi Maxinmicro(无锡明芯微); Supplier Footprint: SOT23-6; JLCPCB Part Class: Extended Part; Datasheet: https://item.szlcsc.com/datasheet/MX66100T/56102987.html; Supplier: LCSC
X2 = X322525MOB4SI: Type:Surface Mount Crystal Frequency:25MHz Normal temperature Frequency Tolerance:±10ppm Normal temperature Frequency Tolerance:±10ppm Load Capacitance:12pF Frequency Stability:±20ppm Frequency Stability:±20ppm Operating Temperature:-40℃~+85℃ Operating Te; LCSC Part Name: YSX321SL 25MHZ 4P 3225 12PF ±10PPM -40~85℃ (±20PPM); Supplier Part: C9006; Manufacturer: YXC(扬兴晶振); Supplier Footprint: SMD3225-4P; JLCPCB Part Class: Basic Part; Datasheet: https://atta.szlcsc.com/upload/public/pdf/source/20240329/19D5F850207469550BEB00D7DFEDBC7A.pdf; Supplier: LCSC; Type: Surface Mount Crystal; Normal temperature Frequency Tolerance: ±10ppm; Load Capacitance: 12pF; Frequency Stability: ±20ppm; Operating Temperature: -40℃~+85℃
C46 C102 C103 = CL31A476MPHNNNE: LCSC Part Name: 47uF ±20% 10V; Supplier Part: C96123; Manufacturer: SAMSUNG(三星); Supplier Footprint: 1206; Datasheet: https://item.szlcsc.com/datasheet/CL31A476MPHNNNE/97327.html; Supplier: LCSC; Tolerance: ±20%; Voltage Rating: 10V; Temperature Coefficient: X5R
CN1 = HX JN1.27-2x7 TP H4.9: LCSC Part Name: 1.27mm 2x7P 排数:2 每排P数:7; Supplier Part: C42455944; Manufacturer: hanxia(韩下); Supplier Footprint: SMD,P=1.27mm; Datasheet: https://item.szlcsc.com/datasheet/HX%2520JN1.27-2x7%2520TP%2520H4.9/44524767.html; Supplier: LCSC; Connector Type: IDC Header; Pitch: 1.27mm; Number of Positions or Pins: 2x7P; Current Rating: 1A; Voltage Rating (Max): 500V; Holder Type: Surface Mount,Vertical; Row Spacing: 1.27mm; Number of Rows: 2; Number of PINs Per Row: 7; Contact Material: Brass; Contact Plating: Gold; Operating Temperature: -40℃~+105℃; Color: Black
F1 F4 F5 = SMD1206B050TF: LCSC Part Name: 6V 500mA 贴片自恢复; Supplier Part: C269115; Manufacturer: Brightking(君耀电子); Supplier Footprint: 1206; JLCPCB Part Class: Extended Part; Datasheet: https://item.szlcsc.com/datasheet/SMD1206B050TF/258573.html; Supplier: LCSC; Voltage - Max: 6V; Current - Max: 100A; Hold Current: 500mA; Trip Current: 1A; Power Dissipation: 600mW; Resistance - Initial (Ri) (Min): 150mΩ; Resistance - Post Trip (R1) (Max): 700mΩ; Time to Trip(Max): 100ms; Operating Temperature: -40℃~+85℃; Length: 3.4mm; Width: 1.8mm; Height: 0.85mm
J3 = U-USBBR04P-F001: Connector Type:Type-B Standard:USB 2.0 Gender:Female Number of Ports:1 Number of Contacts:4P Mounting Style:Right-Angle Current Rating - Power (Max):1.5A Operating Temperature Range:- Operating Temperature Range:-; LCSC Part Name: Type-B 母 弯插; Supplier Part: C386743; Manufacturer: Ckmtw(灿科盟); Supplier Footprint: 插件; JLCPCB Part Class: Extended Part; Datasheet: https://atta.szlcsc.com/upload/public/pdf/source/20190509/C386743_2E7BDE199FB40B6F97679D15D491C286.pdf; Supplier: LCSC; Connector Type: Type-B; Standard: USB 2.0; Gender: Female; Number of Ports: 1; Number of Contacts: 4P; Mounting Style: Right-Angle; Current Rating - Power (Max): 1.5A
LED2 LED4 LED7 LED9 LED11 LED13 LED15 LED16 = WS2812C-4020: LCSC Part Name: SMD灯珠; Supplier Part: C4154870; Manufacturer: worldsemi; Supplier Footprint: SMD,2x4mm; Datasheet: https://atta.szlcsc.com/upload/public/pdf/source/20220711/8D8EEECCEBA49022B4A86B7B3F2B1512.pdf; Supplier: LCSC
R5 R6 R48 = 0603WAF1003T5E: Type:Thick Film Resistor Resistance:100kΩ Tolerance:±1% Tolerance:±1% Power(Watts):100mW Voltage-Supply(Max):75V Temperature Coefficient:±100ppm/℃ Temperature Coefficient:±100ppm/℃ Operating Temperature:-55℃~+155℃ Operating Temperature:-55℃~+155℃; LCSC Part Name: 100kΩ ±1% 100mW 厚膜电阻; Supplier Part: C25803; Manufacturer: UNI-ROYAL(厚声); Supplier Footprint: 0603; JLCPCB Part Class: Basic Part; Datasheet: https://item.szlcsc.com/datasheet/0603WAF1003T5E/26546.html; Supplier: LCSC; Type: Thick Film Resistor; Tolerance: ±1%; Power(Watts): 100mW; Voltage-Supply(Max): 75V; Temperature Coefficient: ±100ppm/℃; Operating Temperature: -55℃~+155℃; Operating Temperature Range: -55℃~+155℃
SW3 = TS-1045-A13B3-D2: Circuit:SPST Actuator Style:Round Button Operating Force:250gf Mounting Style:卧贴 Switch Height:10mm Strike Gundam:带支架 Actuator/Cap Color:Black Pin Style:SMDSplicing Mechanical Life:-; LCSC Part Name: 轻触开关6*6*10带支架贴片支架侧按按键250gf; Supplier Part: C557898; Manufacturer: Yuandi(元迪); Supplier Footprint: SMD; JLCPCB Part Class: Extended Part; Datasheet: https://atta.szlcsc.com/upload/public/pdf/source/20200522/C557886_6DF50336386BA259B6638E5ADB1DAB20.pdf; Supplier: LCSC; Circuit: SPST; Actuator Style: Round Button; Operating Force: 250gf; Mounting Style: 卧贴; Switch Height: 10mm; Strike Gundam: 带支架; Actuator/Cap Color: Black; Pin Style: SMDSplicing
U2 U3 U21 = SN74LVC1G17DBVR: Input type:Schmitt Trigger output type:推挽 Supply Voltage:1.65V~5.5V Supply Voltage:1.65V~5.5V Number of Elements:1 Number of Bits per Element:1 Sink Current:32mA Source Current:32mA Logic Family:74LVC Operating Temperature:-40℃~+125℃ Operating Temperature; Supplier Part: C7836; Manufacturer: TI(德州仪器); Supplier Footprint: SOT-23-5; JLCPCB Part Class: Extended Part; Datasheet: https://www.ti.com/cn/lit/gpn/sn74lvc1g17; Supplier: LCSC; Input type: Schmitt Trigger; output type: 推挽; Supply Voltage: 1.65V~5.5V; Number of Elements: 1; Number of Bits per Element: 1; Sink Current: 32mA; Source Current: 32mA; Logic Family: 74LVC; Operating Temperature: -40℃~+125℃; NO_CONNECT: yes
ANT1 = NFC Antenna: 40x54mm, 1270um track, 508um gap, 35um track thickness, 4 turn, 1.66 turn exponent, NXP calls it a 1445nH, 2.4pF, 0.95R antenna.
C1 C7 = CL10C120JB8NNNC: Capacitance: Tolerance:±5% Tolerance:±5% Voltage Rated: Temperature Coefficient:; LCSC Part Name: 12pF ±5% 50V; Supplier Part: C38523; Manufacturer: SAMSUNG(三星); Supplier Footprint: 0603; JLCPCB Part Class: Basic Part; Datasheet: https://atta.szlcsc.com/upload/public/pdf/source/20160218/1457707763339.pdf; Supplier: LCSC; Tolerance: ±5%
C2 C4 = CL10B474KA8NNNC: Capacitance: Tolerance:±10% Tolerance:±10% Voltage Rated: Temperature Coefficient:; LCSC Part Name: 470nF ±10% 25V; Supplier Part: C1623; Manufacturer: SAMSUNG(三星); Supplier Footprint: 0603; JLCPCB Part Class: Basic Part; Datasheet: https://atta.szlcsc.com/upload/public/pdf/source/20160218/1457707763339.pdf; Supplier: LCSC; Tolerance: ±10%
C9 C20 = CL10B102KB8NNNC: Capacitance: Tolerance:±10% Tolerance:±10% Voltage Rated: Temperature Coefficient:; LCSC Part Name: 1nF ±10% 50V; Supplier Part: C1588; Manufacturer: SAMSUNG(三星); Supplier Footprint: 0603; JLCPCB Part Class: Basic Part; Datasheet: https://atta.szlcsc.com/upload/public/pdf/source/20160218/1457707763339.pdf; Supplier: LCSC; Tolerance: ±10%
C10 C19 = CL10C680JB8NNNC: Capacitance: Tolerance:±5% Tolerance:±5% Voltage Rated: Temperature Coefficient:; LCSC Part Name: 68pF ±5% 50V; Supplier Part: C28262; Manufacturer: SAMSUNG(三星); Supplier Footprint: 0603; JLCPCB Part Class: Extended Part; Datasheet: https://atta.szlcsc.com/upload/public/pdf/source/20160218/1457707763339.pdf; Supplier: LCSC; Tolerance: ±5%
C11 C12 C17 C18 = CL10C121JB8NNNC: Capacitance: Tolerance:±5% Tolerance:±5% Voltage Rated: Temperature Coefficient:; LCSC Part Name: 120pF ±5% 50V; Supplier Part: C18438; Manufacturer: SAMSUNG(三星); Supplier Footprint: 0603; JLCPCB Part Class: Extended Part; Datasheet: https://atta.szlcsc.com/upload/public/pdf/source/20160218/1457707763339.pdf; Supplier: LCSC; Tolerance: ±5%
L1 L2 = MLP1608VR47DT0S1: Inductance: Tolerance:±20% Tolerance:±20% Rated Current: Saturation Current (Isat):- DC Resistance (DCR): Q @ Freq:- Frequency - Self Resonant:- Ratings:; LCSC Part Name: 470nH ±20%; Supplier Part: C105533; Manufacturer: TDK; Supplier Footprint: 0603; Datasheet: https://atta.szlcsc.com/upload/public/pdf/source/20180702/C105533_29B6B2DE07EC923A72FED272F110324B.pdf; Supplier: LCSC; Tolerance: ±20%
M1-M6 = SMTSO30100CTJ: specifications:M3X10 surface treatment:镀锡 Product Description:- material quality:- model:SMTSO30100CTJ brand:Sinhoo(雄和远景); LCSC Part Name: 雄和远景，电路板表贴圆螺母柱，M3X10，铜镀锡,1个; Supplier Part: C2916370; Manufacturer: Sinhoo(雄和远景); JLCPCB Part Class: Extended Part; Datasheet: https://atta.szlcsc.com/upload/public/pdf/source/20211122/17CF5E24EB4D4DC090A80DE3D7DE5E21.pdf; Supplier: LCSC; specifications: M3X10; surface treatment: 镀锡; brand: Sinhoo(雄和远景)
R4 R9 R13 = 0603WAF2202T5E: Type:Thick Film Resistors Resistance:22kΩ Tolerance:±1% Tolerance:±1% Power(Watts): Overload Voltage (Max): Temperature Coefficient:±100ppm/℃ Temperature Coefficient:±100ppm/℃ Operating Temperature Range:-55℃~+155℃ Operating Temperature Range:-55℃~+155℃; LCSC Part Name: 22kΩ ±1% 100mW 厚膜电阻; Supplier Part: C31850; Manufacturer: UNI-ROYAL(厚声); Supplier Footprint: 0603; Datasheet: https://atta.szlcsc.com/upload/public/pdf/source/20200306/C422600_1E6D84923E4A46A82E41ADD87F860B5C.pdf; Supplier: LCSC; Type: Thick Film Resistors; Tolerance: ±1%; Temperature Coefficient: ±100ppm/℃; Operating Temperature Range: -55℃~+155℃
R7 R8 = 0603WAF510KT5E: Type:Thick Film Resistors Resistance:5.1Ω Tolerance:±1% Tolerance:±1% Power(Watts): Overload Voltage (Max): Temperature Coefficient:±200ppm/℃ Temperature Coefficient:±200ppm/℃ Operating Temperature Range:-55℃~+155℃ Operating Temperature Range:-55℃~+155℃; LCSC Part Name: 5.1Ω ±1% 100mW 厚膜电阻; Supplier Part: C25197; Manufacturer: UNI-ROYAL(厚声); Supplier Footprint: 0603; JLCPCB Part Class: Basic Part; Datasheet: https://atta.szlcsc.com/upload/public/pdf/source/20200306/C422600_1E6D84923E4A46A82E41ADD87F860B5C.pdf; Supplier: LCSC; Type: Thick Film Resistors; Tolerance: ±1%; Temperature Coefficient: ±200ppm/℃; Operating Temperature Range: -55℃~+155℃
SW1 SW2 = K9-1267F: Type:Micro Switch Circuit:SPDT Switch Length:12.7mm Switch Width:5.7mm Switch Height:12.8mm Contact Current (DC):100mA Voltage Rating (DC):30V Contact Current (AC):1A Voltage Rating (AC):125V Mechanical Life:300万次 Operating Temperature:-25℃~+85℃ Operating; LCSC Part Name: 12.7*5.7*12.8mm 插件微动开关; Supplier Part: C107263; Manufacturer: 韩国韩荣; Supplier Footprint: 插件; JLCPCB Part Class: Extended Part; Datasheet: https://atta.szlcsc.com/upload/public/pdf/source/20201214/C107263_D9656DE761E5BF43078859A56D7E33A8.pdf; Supplier: LCSC; Type: Micro Switch; Circuit: SPDT; Switch Length: 12.7mm; Switch Width: 5.7mm; Switch Height: 12.8mm; Contact Current (DC): 100mA; Voltage Rating (DC): 30V; Contact Current (AC): 1A; Voltage Rating (AC): 125V; Mechanical Life: 300万次; Operating Temperature: -25℃~+85℃
U1 = MFRC63003HNE: Supplier Part: C1526298; Manufacturer: NXP(恩智浦); Supplier Footprint: HVQFN-32-EP(5x5); JLCPCB Part Class: Extended Part; Datasheet: https://atta.szlcsc.com/upload/public/pdf/source/20230811/188CF1E38A54086FF38BC20E6B5F5B97.pdf; Supplier: LCSC
X1 = X32252712MMB4SI: Crystal Type:Surface Mount Crystal Frequency: Normal temperature Frequency Tolerance:±10ppm Normal temperature Frequency Tolerance:±10ppm Load Capacitance: Frequency Stability:±20ppm Frequency Stability:±20ppm Operating Temperature: Operating Temperature:; LCSC Part Name: 27.12MHz ±10ppm 10pF; Supplier Part: C29975; Manufacturer: YXC(扬兴晶振); Supplier Footprint: SMD3225-4P; JLCPCB Part Class: Extended Part; Datasheet: https://atta.szlcsc.com/upload/public/pdf/source/20240329/19D5F850207469550BEB00D7DFEDBC7A.pdf; Supplier: LCSC; Crystal Type: Surface Mount Crystal; Normal temperature Frequency Tolerance: ±10ppm; Frequency Stability: ±20ppm
C44 C52 = CL10B333KB8NNNC: LCSC Part Name: 33nF ±10% 50V; Supplier Part: C21117; Manufacturer: SAMSUNG(三星); Supplier Footprint: 0603; Datasheet: https://item.szlcsc.com/datasheet/CL10B333KB8NNNC/21829.html; Supplier: LCSC; Tolerance: ±10%; Voltage Rating: 50V; Temperature Coefficient: X7R
C45 = 0603CG300J500NT: LCSC Part Name: 30pF ±5% 50V; Supplier Part: C1658; Manufacturer: FH(风华); Supplier Footprint: 0603; Datasheet: https://item.szlcsc.com/datasheet/0603CG300J500NT/2010.html; Supplier: LCSC; Tolerance: ±5%; Voltage Rating: 50V; Temperature Coefficient: C0G
D1 D2 = B5819W SL: LCSC Part Name: 电压:40V 电流:1A; Supplier Part: C8598; Manufacturer: CJ(江苏长电/长晶); Supplier Footprint: SOD-123; Datasheet: https://item.szlcsc.com/datasheet/B5819W%2520SL/9093.html; Supplier: LCSC; Voltage - Forward(Vf@If): 600mV@1A; Voltage - DC Reverse(Vr): 40V; Current - Rectified: 1A; Non-Repetitive Peak Forward Surge Current: 9A
L3 L4 = DH0650H-4R7M: LCSC Part Name: DH0650H-4R7M（4.7uH); Supplier Part: C41407096; Manufacturer: DH(德鸿感应); Supplier Footprint: SMD,7.1x6.6mm; Datasheet: https://item.szlcsc.com/datasheet/DH0650H-4R7M/43206137.html; Supplier: LCSC; Tolerance: ±20%; Current Rating: 6A; Current - Saturation(Isat): 9A; DC Resistance(DCR): 18.5mΩ; Type: Molded Inductor
R18 = 0603WAF5102T5E: LCSC Part Name: 51kΩ ±1% 100mW 厚膜电阻; Supplier Part: C23196; Manufacturer: UNI-ROYAL(厚声); Supplier Footprint: 0603; JLCPCB Part Class: Basic Part; Datasheet: https://item.szlcsc.com/datasheet/0603WAF5102T5E/23923.html; Supplier: LCSC; Type: Thick Film Resistor; Tolerance: ±1%; Power(Watts): 100mW; Voltage-Supply(Max): 75V; Temperature Coefficient: ±100ppm/℃; Operating Temperature: -55℃~+155℃
U5 U6 = TPS62933DRLR: Supplier Part: C3200405; Manufacturer: TI(德州仪器); Supplier Footprint: SOT-583; Datasheet: https://www.ti.com/cn/lit/gpn/tps62933f; Supplier: LCSC; Function: Step-down type; Output Type: Adjustable; Input Voltage: 3.8V~30V; Output Voltage: 800mV~22V; Output Current: 3A; Switching Frequency: 2.2MHz; Operating Temperature: -40℃~+150℃@(TJ); Synchronous Rectification: Yes; Number of Outputs: 1; Topology: Step-down; Switch tube (built-in/external): Built-in

## Nets
+5V: C5.2 C6.2 C22.2 C26.2 C29.2 C32.2 C33.2 C36.2 C37.2 C38.2 C101.1 C104.2 D2.2(+) F3.1 F4.1 LED2.2(VDD) LED4.2(VDD) LED7.2(VDD) LED9.2(VDD) LED11.2(VDD) LED13.2(VDD) LED15.2(VDD) LED16.2(VDD) U1.18(TVDD) U4.6(VOUT) U7.6(VOUT) U31.1(VIN)
+5V-BUS: C88.2 C89.2 DSUB1.6 DSUB1.13 F3.2
+12V: C48.2 C49.2 C50.2 C105.2 D1.2(+) F2.1 U6.3(VIN)
+12V-BUS: C90.2 C91.2 C92.2 C93.2 C94.2 DSUB1.4 DSUB1.5 F2.2
AVDD: C23.2 C24.2 C25.2 C27.2 C28.2 C98.2 C100.2 FB2.2 R21.2 R22.2 R24.2 U30.4(AVDD) U30.8(AVDD) U30.11(AVDD) U30.15(AVDD) U30.17(AVDD) U30.21(AVDD)
GND: C1.1 C2.2 C3.1 C4.1 C5.1 C6.1 C7.1 C8.1 C11.1 C12.1 C13.1 C14.1 C15.1 C16.1 C17.2 C18.2 C21.1 C22.1 C23.1 C24.1 C25.1 C26.1 C27.1 C28.1 C29.1 C31.1 C32.1 C33.1 C35.1 C36.1 C37.1 C38.1 C39.2 C40.1 C41.1 C42.1 C44.2 C46.1 C47.1 C48.1 C49.1 C50.1 C52.2 C55.1 C56.1 C57.1 C58.1 C59.1 C60.2 C68.1 C69.1 C80.2 C82.2 C88.1 C89.1 C90.1 C91.1 C92.1 C93.1 C94.1 C95.2 C96.1 C97.1 C98.1 C99.1 C100.1 C101.2 C102.2 C103.1 C104.1 C105.1 CN1.12 CN1.13 CN1.14 D5.2 DSUB1.3 DSUB1.10 DSUB1.11 DSUB1.14 DSUB1.16 DSUB1.17 J1.8 J1.13(SHELL) J3.4(GND) LED2.4(VSS) LED4.4(VSS) LED7.4(VSS) LED9.4(VSS) LED11.4(VSS) LED13.4(VSS) LED15.4(VSS) LED16.4(VSS) R1.1 R14.2 R16.1 R17.2 SW1.1(C) SW2.1(C) SW3.2 SW3.3(GND) U1.16(TVSS) U1.26(IFSEL0/OUT4) U1.33(EP) U2.3(GND) U3.3(GND) U4.2(GND) U5.4(GND) U6.4(GND) U7.2(GND) U21.3(GND) U29.3(GND) U30.3(AGND) U30.9(AGND) U30.14(AGND) U30.16(AGND) U30.19(AGND) U30.23(RSVD) U30.29(GND) U30.48(AGND) U31.2(GND) X1.2(GND) X1.4(GND) X2.2(GND) X2.4(GND)
VCC: C3.2 C15.2 C16.2 C45.2 C46.2 C47.2 C69.2 C95.1 F5.2 FB1.1 FB2.1 L3.2 R2.2 R5.1 R6.1 R13.1 R15.1 R38.2 R39.2 R40.1 R41.1 R48.1 U1.8(VDD) U1.25(PVDD) U1.27(IFSEL1/OUT5) U2.5(VCC) U3.5(VCC) U21.5(VCC) U29.5(VCC)
VDD: C21.2 C99.2 FB1.2 U30.28(VDD)
ACCESS: DSUB1.1
BUSIO1: DSUB1.8
BUSIO2: DSUB1.9
BUSIO3: DSUB1.12
BUSIO4: DSUB1.15
BUTTON: U21.4(Y)
CS_NFC: U1.31(IF3)
DET1: U2.4(Y)
DET2: U3.4(Y)
DM: D5.1 D5.6 J3.2(D-)
DP: D5.3 D5.4 J3.3(D+)
ETH_CS: R41.2 U29.1(OE) U30.32(SCSn)
ETH_INT: R40.2 U30.36(INTn)
ETH_LEDs: U31.3(ON)
ETH_RST: R15.2 U30.37(RSTn)
INTERRUPT: DSUB1.7 R39.1
IRQ: R2.1 U1.32(IRQ)
LEDFRONT: LED2.1(DIN)
MISO: U1.30(IF2) U29.4(Y)
MOSI: U1.28(IF0) U30.35(MOSI)
NFCRXN: C9.1 R3.1 U1.13(RXN)
NFCRXP: C20.1 R10.1 U1.12(RXP)
ONEWIRE: CN1.11 DSUB1.2 R38.1
PDOWN: R1.2 U1.21(PDOWN)
RXN: C34.2 R28.2 U30.5(RXN)
RXP: C30.2 R27.2 U30.6(RXP)
SCK: U1.29(IF1) U30.33(SCLK)
SCREEN1: CN1.5
SCREEN2: CN1.7
SCREEN3: CN1.9
SCREEN4: CN1.6
SCREEN5: CN1.8
SCREEN6: CN1.10
TX1: L2.1 U1.17(TX1)
TX2: L1.1 U1.15(TX2)
TXN: J1.2 R22.1 U30.1(TXN)
TXP: J1.1 R21.1 U30.2(TXP)
VLED: R25.2 R26.2 U31.6(VOUT)
VMID: C8.2 R3.2 R10.2 U1.14(VMID)
VUSB: D5.5 F1.1 J3.1(VCC)
W_ACT: J1.11(D3+) U30.27(ACTLED)
W_LINK: J1.10(D2-) U30.25(LINKLED)
W_MISO: U29.2(A) U30.34(MISO)
W_XI: C80.1 R23.1 U30.30(XI/CLKIN) X2.3(OSC2)
W_XO: C82.1 R23.2 U30.31(XO) X2.1(OSC1)
$2N2483: C4.2 U1.9(AVDD)
$2N2484: C2.1 U1.7(DVDD)
$2N2490: C7.2 U1.19(XTAL1) X1.1(OSC1)
$2N2492: C1.2 U1.20(XTAL2) X1.3(OSC2)
$2N2516: C10.1 C11.2 L1.2 R4.2
$2N2517: C17.1 C19.1 L2.2 R9.2
$2N2518: C18.1 C19.2 R8.1
$2N2519: C10.2 C12.2 R7.1
$2N2522: ANT1.2 R8.2
$2N2523: ANT1.1 R7.2
$2N2526: C20.2 R9.1
$2N2527: C9.2 R4.1
$2N2535: C13.2 R5.2 SW1.2(NO) U2.2(A)
$2N2541: C14.2 R6.2 SW2.2(NO) U3.2(A)
$4N1021: LED7.3(DOUT) LED9.1(DIN)
$4N1022: LED4.3(DOUT) LED7.1(DIN)
$4N1023: LED2.3(DOUT) LED4.1(DIN)
$4N1025: LED9.3(DOUT) LED11.1(DIN)
$4N1026: LED11.3(DOUT) LED13.1(DIN)
$4N1027: LED13.3(DOUT) LED15.1(DIN)
$4N1028: LED15.3(DOUT) LED16.1(DIN)
$4N1123: C39.1 F1.2 U4.1(VIN) U4.3(ON)
$4N2195: C68.2 R48.2 SW3.1 U21.2(A)
$6N1500: C40.2 C41.2 C42.2 D1.1(-) D2.1(-) U5.3(VIN)
$6N1512: C43.1 U5.6(BST)
$6N1514: C43.2 L3.1 U5.5(SW)
$6N1519: C44.1 U5.7(SS)
$6N1532: C45.1 R11.2 R14.1 U5.8(FB)
$6N1538: R11.1 R13.2
$6N1557: C51.1 U6.6(BST)
$6N1559: C51.2 L4.1 U6.5(SW)
$6N1564: C52.1 U6.7(SS)
$6N1580: R17.1 R20.1 U6.8(FB)
$6N1585: C55.2 C56.2 C57.2 C58.2 C59.2 C60.1 L4.2 R18.2 U7.1(VIN) U7.3(ON)
$6N1603: R18.1 R19.2
$6N1605: R19.1 R20.2
$7N2177: C96.2 U30.22(1V2O)
$7N2179: C31.2 U30.20(TOCAP)
$7N2183: R16.2 U30.10(EXRES1)
$7N2200: J1.9(D1+) R26.1
$7N2211: C35.2 J1.4 R24.1
$7N2212: C30.1 J1.3
$7N2220: C97.2 J1.5 R27.1 R28.1
$7N2221: C34.1 J1.6
$7N2225: J1.12(D4-) R25.1
Net-(C102-1): C102.1 CN1.1 CN1.3 F4.2
Net-(C103-2): C103.2 CN1.2 CN1.4 F5.1

Not connected (* = marked no-connect by the designer): D4 1 2 3 4 5 6; J1 7*; J3 5(SHLD)* 6(SHLD)*; LED16 3(DOUT)*; M1 1* 2* 3* 4*; M2 1* 2* 3* 4*; M3 1* 2* 3* 4*; M4 1* 2* 3* 4*; M5 1* 2* 3* 4*; M6 1* 2* 3* 4*; SW1 3(NC)*; SW2 3(NC)*; U1 1(TDO/OUT0)* 2(TDI/OUT1)* 3(TMS/OUT2)* 4(TCK/OUT3)* 5(SIGIN/OUT7)* 6(SIGOUT)* 10(AUX1)* 11(AUX2)* 22(CLKOUT/OUT6)* 23(SCL)* 24(SDA)*; U2 1(N.C)*; U3 1(N.C)*; U4 4(NC)* 5(NC)*; U5 1(RT)* 2(EN)*; U6 1(RT)* 2(EN)*; U7 4(NC)* 5(NC)*; U8 1(VCCA) 2(GND) 3(A) 4(B) 5(DIR) 6(VCCB); U9 1(VCCA) 2(GND) 3(A) 4(B) 5(DIR) 6(VCCB); U10 1(VCCA) 2(GND) 3(A) 4(B) 5(DIR) 6(VCCB); U11 1(VCCA) 2(GND) 3(A) 4(B) 5(DIR) 6(VCCB); U13 1(VCCA) 2(GND) 3(A) 4(B) 5(DIR) 6(VCCB); U21 1(N.C)*; U30 7(DNC)* 12(NC)* 13(NC)* 18(VBG)* 24(SPDLED)* 26(DUPLED)* 38(RSVD)* 39(RSVD)* 40(RSVD)* 41(RSVD)* 42(RSVD)* 43(PMODE2)* 44(PMODE1)* 45(PMODE0)* 46(NC)* 47(NC)*; U31 4(NC)* 5(NC)*

## Notes on the sheets
sheet 2
- SPI Config
- NFC Controller
- NFC Atenna
- Card Detection Switches
- Card Detect 1
- Card Detect 2
sheet 3
- USB Type B Port
- Side Firing LEDs
- Screen/Expansion Interface
sheet 4
- Bus 15P Connection
- Bus GPIO Transceivers
- TODO: 3.3v ESD for OneWire, Interrupt
- TODO: ESD for 12V
- 1A Hold, 1.8A Trip Self-Healing Fuse
- Access Output Level Shift
sheet 5
- 3.3v 1A Regulator
- Runs on 12v or 5v, whichever is present
- 3.36v Actual
- 12v -> 5v 1A Regulator
- 5.04v Actual
sheet 6
- MISO Tri-State Buffer
- LED Power Switch
